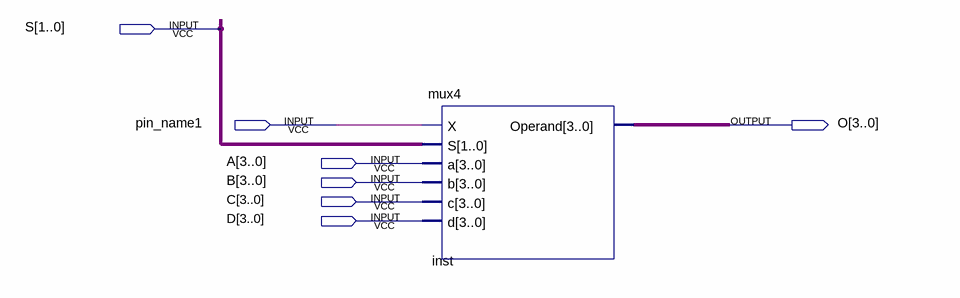
[diagram p0: schematic sheet]
// Quartus schematic Block6.bdf as structural Verilog: 1 symbols, 7 pins
module Block6 (
  input  [1:0] S,
  input  pin_name1,
  input  [3:0] A,
  input  [3:0] B,
  input  [3:0] C,
  input  [3:0] D,
  output [3:0] O
);

  mux4 inst (.X(pin_name1), .S(S), .a(A), .b(B), .c(C), .d(D), .Operand(O));
endmodule
